# Altium schematic sheet Sun_Gold_Power_#2.SchDoc
size A4
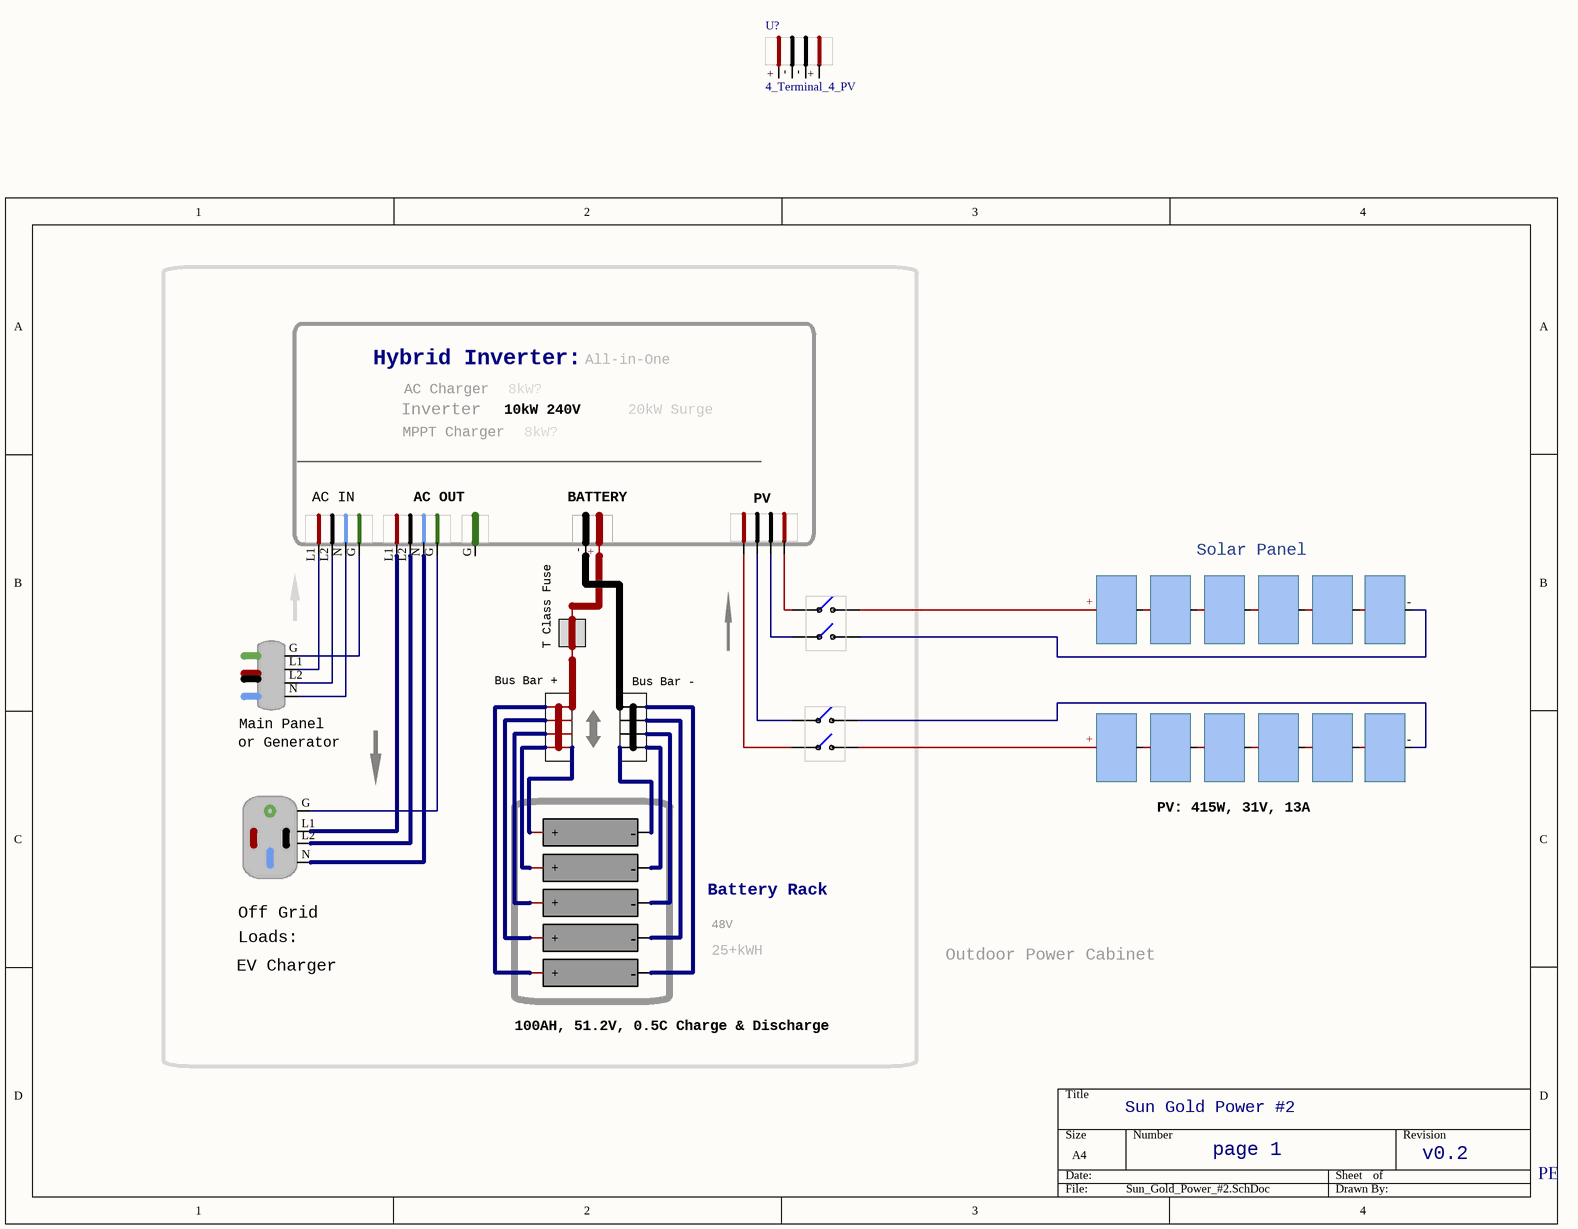
[diagram p0: Sun_Gold_Power_#2.SchDoc]

## Parts
(Parts that share a designator on the sheet are numbered #1, #2 ... from top to bottom, then left to right.)
Battery  1_BAT_48V_new  (value not drawn)
Battery?#1  1_BAT_48V_new  (value not drawn)
Battery?#2  1_BAT_48V_new  (value not drawn)
Battery?#3  1_BAT_48V_new  (value not drawn)
Battery?#4  1_BAT_48V_new  (value not drawn)
K003  3_Switch_2_box_narrow  (value not drawn)
K380  3_Switch_2_box_narrow  (value not drawn)
U?#1  4_Terminal_4_PV
U?#2  4_Terminal_4_AC  (value not drawn)
U?#3  4_Terminal_4_AC  (value not drawn)
U?#4  4_Terminal_1_Ground  (value not drawn)
U?#5  4_Terminal_2_Battery  (value not drawn)
U?#6  4_Terminal_4_PV  (value not drawn)
U?#7  0_Solar_Panel_36V_new  (value not drawn)
U?#8  0_Solar_Panel_36V_new  (value not drawn)
U?#9  0_Solar_Panel_36V_new  (value not drawn)
U?#10  0_Solar_Panel_36V_new  (value not drawn)
U?#11  0_Solar_Panel_36V_new  (value not drawn)
U?#12  0_Solar_Panel_36V_new  (value not drawn)
U?#13  3_Fuse_1_Red  (value not drawn)
U?#14  5_AC_4_Socket  (value not drawn)
U?#15  3_Bus_Bar_Red  (value not drawn)
U?#16  3_Bus_Bar_Black  (value not drawn)
U?#17  0_Solar_Panel_36V_new  (value not drawn)
U?#18  0_Solar_Panel_36V_new  (value not drawn)
U?#19  0_Solar_Panel_36V_new  (value not drawn)
U?#20  0_Solar_Panel_36V_new  (value not drawn)
U?#21  0_Solar_Panel_36V_new  (value not drawn)
U?#22  0_Solar_Panel_36V_new  (value not drawn)
U?#23  5_AC_4_Plug  (value not drawn)

## Blocks framed on the sheet
Hybrid Inverter:: U?#2-U?#6

## Nets
NetBattery?#1_1: Battery?#1.1(-) U?#16.4
NetBattery?#1_2: Battery?#1.2(+) U?#15.6
NetBattery?#2_1: Battery?#2.1(-) U?#16.5
NetBattery?#2_2: Battery?#2.2(+) U?#15.6
NetBattery?#3_1: Battery?#3.1(-) U?#16.1
NetBattery?#3_2: Battery?#3.2(+) U?#15.6
NetBattery?#4_1: Battery?#4.1(-) U?#16.3
NetBattery?#4_2: Battery?#4.2(+) U?#15.6
NetBattery_1: Battery.1(-) U?#16.6
NetBattery_2: Battery.2(+) U?#15.4
NetK003_1: K003.1 U?#7.+
NetK003_2: K003.2 U?#12.-
NetK003_3: K003.3 U?#6.+
NetK003_4: K003.4 U?#6.-
NetK380_1: K380.1 U?#22.-
NetK380_2: K380.2 U?#17.+
NetK380_3: K380.3 U?#6.-
NetK380_4: K380.4 U?#6.+
NetU?#2_G: U?#2.G U?#14.G
NetU?#2_L1: U?#2.L1 U?#14.L1
NetU?#2_L2: U?#2.L2 U?#14.L2
NetU?#2_N: U?#2.N U?#14.N
NetU?#3_G: U?#3.G U?#23.G
NetU?#3_L1: U?#3.L1 U?#23.L1
NetU?#3_L2: U?#3.L2 U?#23.L2
NetU?#3_N: U?#3.N U?#23.N
NetU?#5_+: U?#5.+ U?#13.2
NetU?#5_-: U?#5.- U?#16.6
NetU?#7_-: U?#7.- U?#8.+
NetU?#8_-: U?#8.- U?#9.+
NetU?#9_-: U?#9.- U?#10.+
NetU?#10_-: U?#10.- U?#11.+
NetU?#13_1: U?#13.1 U?#15.3
NetU?#17_-: U?#17.- U?#18.+
NetU?#18_-: U?#18.- U?#19.+
NetU?#19_-: U?#19.- U?#20.+
NetU?#20_-: U?#20.- U?#21.+

Not connected (* = marked no-connect by the designer): U?#1 + -; U?#4 G; U?#11 -; U?#12 +; U?#15 1 5; U?#21 -; U?#22 +

## Notes on the sheet
- All-in-One
- Inverter
- MPPT Charger
- AC Charger
- 10kW 240V
- 8kW?
- 20kW Surge
- (near U?#2) AC IN
- (near U?#3) AC OUT
- (near U?#5) BATTERY
- (near U?#6) PV
- (near U?#9) Solar Panel
- (near U?#13) T Class Fuse
- (near U?#15) Bus Bar +
- (near U?#16) Bus Bar -
- (near U?#14) or Generator
- (near U?#14) Main Panel
- (near U?#18) PV: 415W, 31V, 13A
- Battery Rack
- EV Charger
- (near U?#23) Off Grid
- Loads:
- 25+kWH
- 48V
- Outdoor Power Cabinet
- (near Battery?#4) 100AH, 51.2V, 0.5C Charge & Discharge
- Sun Gold Power #2
- page 1
- v0.2
- PE